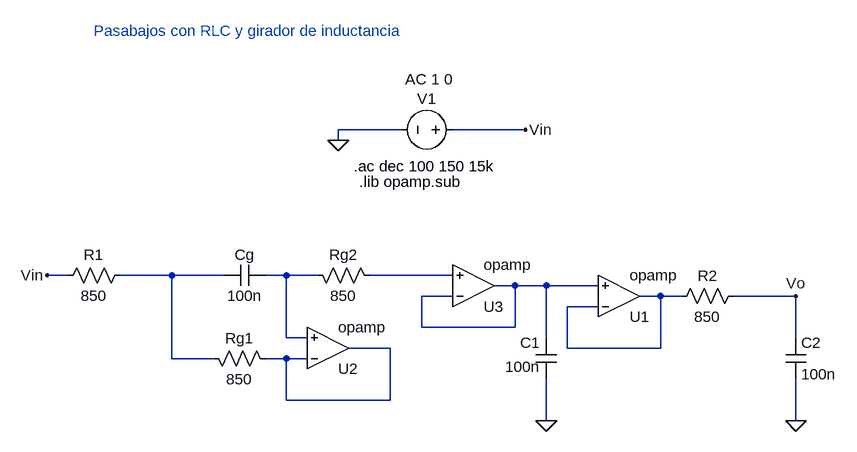
[diagram p0: schematic Circuito_Girador2.asc]
Circuito_Girador2.asc, the LTspice schematic file:
Version 4
SHEET 1 880 680
WIRE -160 -128 -256 -128
WIRE 32 -128 -80 -128
WIRE -256 -112 -256 -128
WIRE -672 96 -704 96
WIRE -512 96 -592 96
WIRE -432 96 -512 96
WIRE -336 96 -368 96
WIRE -288 96 -336 96
WIRE -80 96 -208 96
WIRE 16 112 -16 112
WIRE 64 112 16 112
WIRE 144 112 64 112
WIRE -80 128 -128 128
WIRE 240 128 208 128
WIRE 272 128 240 128
WIRE 448 128 352 128
WIRE 144 144 96 144
WIRE -128 176 -128 128
WIRE 16 176 16 112
WIRE 16 176 -128 176
WIRE -336 192 -336 96
WIRE -304 192 -336 192
WIRE 64 192 64 112
WIRE 448 192 448 128
WIRE -176 208 -240 208
WIRE 96 208 96 144
WIRE 240 208 240 128
WIRE 240 208 96 208
WIRE -512 224 -512 96
WIRE -448 224 -512 224
WIRE -336 224 -368 224
WIRE -304 224 -336 224
WIRE -336 288 -336 224
WIRE -176 288 -176 208
WIRE -176 288 -336 288
WIRE 64 320 64 256
WIRE 448 320 448 256
FLAG 448 320 0
FLAG -704 96 Vin
FLAG 448 128 Vo
FLAG -256 -112 0
FLAG 32 -128 Vin
FLAG 64 320 0
SYMBOL OpAmps\\opamp 176 192 M180
SYMATTR InstName U1
SYMBOL res -576 80 R90
WINDOW 0 0 56 VBottom 2
WINDOW 3 32 56 VTop 2
SYMATTR InstName R1
SYMATTR Value 850
SYMBOL res 368 112 R90
WINDOW 0 0 56 VBottom 2
WINDOW 3 32 56 VTop 2
SYMATTR InstName R2
SYMATTR Value 850
SYMBOL cap 48 192 R0
WINDOW 0 -24 8 Left 2
WINDOW 3 -47 45 Left 2
SYMATTR InstName C1
SYMATTR Value 100n
SYMBOL cap 432 192 R0
SYMATTR InstName C2
SYMATTR Value 100n
SYMBOL voltage -64 -128 R90
WINDOW 0 -32 56 VBottom 2
WINDOW 3 32 56 VTop 2
WINDOW 123 -62 52 VBottom 2
WINDOW 39 0 0 Left 0
SYMATTR InstName V1
SYMATTR Value ""
SYMATTR Value2 AC 1 0
SYMBOL OpAmps\\opamp -272 272 M180
SYMATTR InstName U2
SYMBOL cap -368 112 M270
WINDOW 0 32 32 VTop 2
WINDOW 3 0 32 VBottom 2
SYMATTR InstName Cg
SYMATTR Value 100n
SYMBOL res -192 112 M270
WINDOW 0 32 56 VTop 2
WINDOW 3 0 56 VBottom 2
SYMATTR InstName Rg2
SYMATTR Value 850
SYMBOL res -352 240 M270
WINDOW 0 32 56 VTop 2
WINDOW 3 0 56 VBottom 2
SYMATTR InstName Rg1
SYMATTR Value 850
SYMBOL OpAmps\\opamp -48 176 M180
SYMATTR InstName U3
TEXT -224 -48 Left 2 !.lib opamp.sub
TEXT -232 -72 Left 2 !.ac dec 100 150 15k
TEXT -632 -280 Left 2 ;Pasabajos con RLC y girador de inductancia

The netlist it stands for:
* Circuito_Girador2.asc
XU1 N005 N004 N005 opamp Aol=100K GBW=10Meg  ; pins invin noninvin out
R1 N001 Vin 850
R2 Vo N005 850
C1 N004 0 100n
C2 Vo 0 100n
V1 Vin 0 AC 1 0
XU2 N006 N002 N006 opamp Aol=100K GBW=10Meg  ; pins invin noninvin out
Cg N002 N001 100n
Rg2 N003 N002 850
Rg1 N006 N001 850
XU3 N004 N003 N004 opamp Aol=100K GBW=10Meg  ; pins invin noninvin out
.lib opamp.sub
.ac dec 100 150 15k
* Pasabajos con RLC y girador de inductancia
.backanno
.end

* Results of the author's LTspice run, read from the files saved beside the schematic
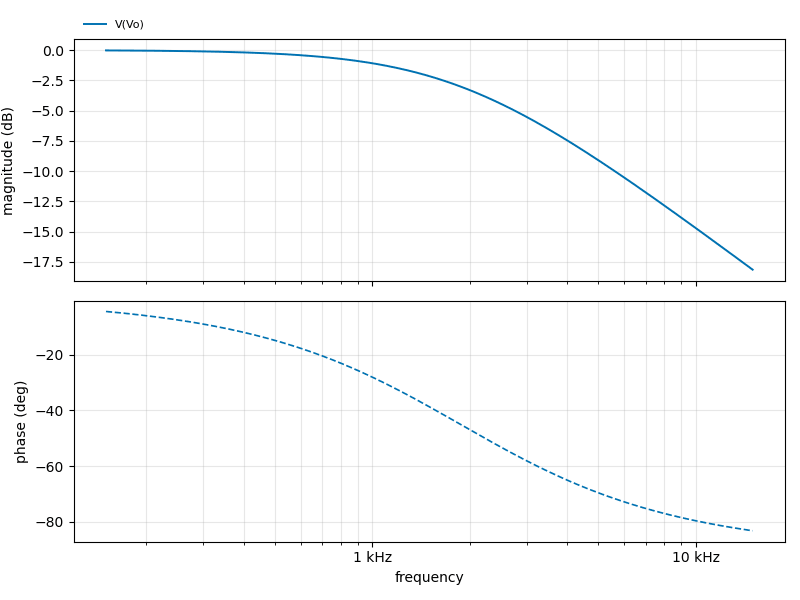
[diagram p1: AC Analysis of Circuito_Girador2.asc, plotted from the saved traces]
* AC Analysis, 1 run:
*   V(Vo): -0.03 dB at 150 Hz, -18.14 dB at 15 kHz, peak -0.03 dB at 150 Hz, 3 dB below the peak at 1.884 kHz